# EAGLE design Arduino-Pro-Mini (EAGLE 9.5.1)
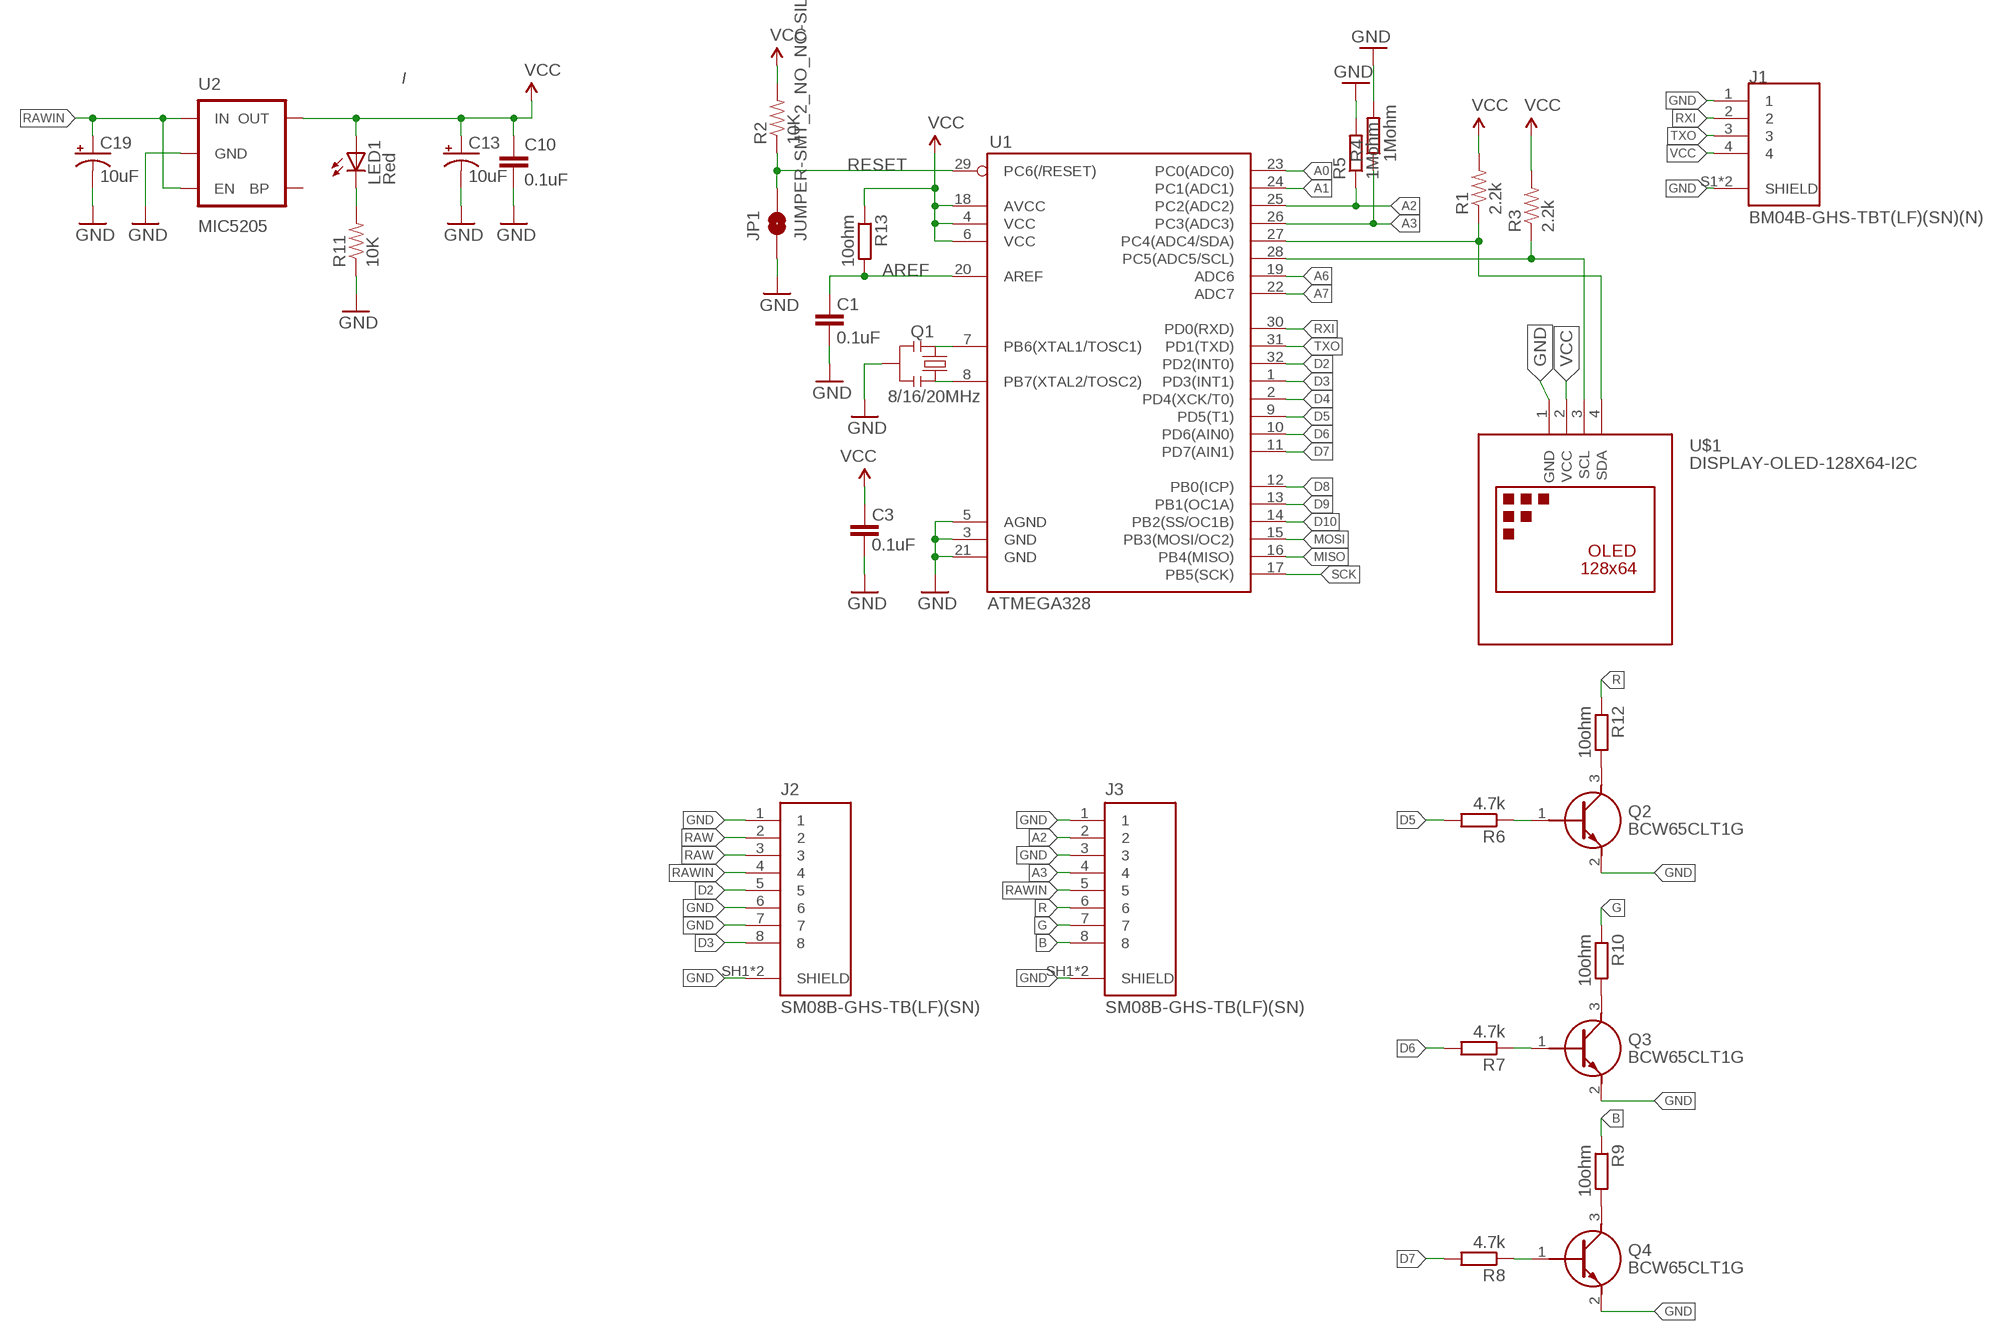
[diagram p0: schematic, sheet 1]

## Parts
C1  0.1uF  CAP0603-CAP  [0603-CAP]
C3  0.1uF  CAP0603-CAP  [0603-CAP]
C10  0.1uF  CAP0603-CAP  [0603-CAP]
C13  10uF  CAP_POL1206  [EIA3216]
C19  10uF  CAP_POL1206  [EIA3216]
J1  BM04B-GHS-TBT(LF)(SN)(N)  [JST_BM04B-GHS-TBT(LF)(SN)(N)]
J2  SM08B-GHS-TB(LF)(SN)  [JST_SM08B-GHS-TB(LF)(SN)]
J3  SM08B-GHS-TB(LF)(SN)  [JST_SM08B-GHS-TB(LF)(SN)]
JP1  JUMPER-SMT_2_NO_NO-SILK  [SMT-JUMPER_2_NO_NO-SILK]
LED1  Red  LED  [0603-LED-ALT1]
Q1  8/16/20MHz  RESONATOR1:1  [RESONATOR-SMD-1:1]
Q2  BCW65CLT1G  [SOT96P237X111-3N]
Q3  BCW65CLT1G  [SOT96P237X111-3N]
Q4  BCW65CLT1G  [SOT96P237X111-3N]
R1  2.2k  RESISTOR0603-RES  [0603-RES]
R2  10K  RESISTOR0603-RES  [0603-RES]
R3  2.2k  RESISTOR0603-RES  [0603-RES]
R4  1Mohm  RR0402  [R0402]
R5  1Mohm  RR0402  [R0402]
R6  4.7k  RR0402  [R0402]
R7  4.7k  RR0402  [R0402]
R8  4.7k  RR0402  [R0402]
R9  10ohm  RR0402  [R0402]
R10  10ohm  RR0402  [R0402]
R11  10K  RESISTOR0603-RES  [0603-RES]
R12  10ohm  RR0402  [R0402]
R13  10ohm  RR0402  [R0402]
U1  ATMEGA328  ATMEGA168  [TQFP32-08]
U2  MIC5205  V_REG_LDOSMD  [SOT23-5]
U$1  DISPLAY-OLED-128X64-I2C  [DISPLAY-OLED-128X64-I2C]

## Nets
A0: U1.23(PC0(ADC0))
A1: U1.24(PC1(ADC1))
A2: J3.2 R5.1 U1.25(PC2(ADC2))
A3 [vcc]: J3.4 R4.1 U1.26(PC3(ADC3))
A4: R1.1 U1.27(PC4(ADC4/SDA)) U$1.4(SDA)
A5: R3.1 U1.28(PC5(ADC5/SCL)) U$1.3(SCL)
A6: U1.19(ADC6)
A7: U1.22(ADC7)
AREF: C1.2 R13.2 U1.20(AREF)
B: J3.8 R9.1
D2: J2.5 U1.32(PD2(INT0))
D3: J2.8 U1.1(PD3(INT1))
D4: U1.2(PD4(XCK/T0))
D5: R6.2 U1.9(PD5(T1))
D6: R7.2 U1.10(PD6(AIN0))
D7: R8.2 U1.11(PD7(AIN1))
D8: U1.12(PB0(ICP))
D9: U1.13(PB1(OC1A))
D10: U1.14(PB2(SS/OC1B))
G: J3.7 R10.1
GND [vcc]: C1.1 C3.1 C10.2 C13.C(-) C19.C(-) J1.1 J1.S1(SHIELD) J1.S2(SHIELD) J2.1 J2.6 J2.7 J2.SH1(SHIELD) J2.SH2(SHIELD) J3.1 J3.3 J3.SH1(SHIELD) J3.SH2(SHIELD) JP1.1 Q1.2 Q2.2(E) Q3.2(E) Q4.2(E) R4.2 R5.2 R11.1 U1.3(GND) U1.5(AGND) U1.21(GND) U2.2(GND) U$1.1(GND)
MISO: U1.16(PB4(MISO))
MOSI: U1.15(PB3(MOSI/OC2))
N$1: Q1.3 U1.8(PB7(XTAL2/TOSC2))
N$2: Q1.1 U1.7(PB6(XTAL1/TOSC1))
N$3: Q4.1(B) R8.1
N$4: LED1.C R11.2
N$5: Q3.1(B) R7.1
N$6: Q2.1(B) R6.1
N$7: Q4.3(C) R9.2
N$8: Q3.3(C) R10.2
N$9: Q2.3(C) R12.2
R: J3.6 R12.1
RAW [vcc]: J2.2 J2.3
RAWIN [vcc]: C19.A(+) J2.4 J3.5 U2.1(IN) U2.3(EN)
RESET: JP1.2 R2.1 U1.29(PC6(/RESET))
RXI: J1.2 U1.30(PD0(RXD))
SCK: U1.17(PB5(SCK))
TXO: J1.3 U1.31(PD1(TXD))
VCC: C3.2 C10.1 C13.A(+) J1.4 LED1.A R1.2 R2.2 R3.2 R13.1 U1.4(VCC) U1.6(VCC) U1.18(AVCC) U2.5(OUT) U$1.2(VCC)
Unconnected: U2.4(BP)

## Library data of the parts
C1 C3 C10 = SparkFun:CAP: Capacitor Standard 0603 ceramic capacitor, and 0.1" leaded capacitor.
C13 C19 = SparkFun:CAP_POL: Capacitor Polarized These are standard SMD and PTH capacitors. Normally 10uF, 47uF, and 100uF in electrolytic and tantalum varieties. Always verify the external diameter of the through hole cap, it varies with capacity, voltage, and manufacturer. The EIA devices should be standard.
J1 = BM04B-GHS-TBT_LF__SN__N_:BM04B-GHS-TBT(LF)(SN)(N): Conn Shrouded Header HDR 4 POS 1.25mm Solder ST SMD Reel; AVAILABILITY: Unavailable; DESCRIPTION: Conn Shrouded Header HDR 4 POS 1.25mm Solder ST SMD Reel; MF: JST Sales; MP: BM04B-GHS-TBT_LF__SN__N_; PACKAGE: None; PRICE: None
J2 J3 = SM08B-GHS-TB_LF__SN_:SM08B-GHS-TB(LF)(SN): GH Series 8 Position 1.25 mm Pitch Side Entry Shrouded Header; AVAILABILITY: Unavailable; DESCRIPTION: GH Series 8 Position 1.25 mm Pitch Side Entry Shrouded Header; MF: JST Sales; MP: SM08B-GHS-TB_LF__SN_; PACKAGE: None; PRICE: None
JP1 = SparkFun-Jumpers:JUMPER-SMT_2_NO: Normally open jumper This jumper has two pads in close proximity to each other. Apply solder to close the connection. Round pads are easier to solder for beginners, but are a lot larger. SparkFun Product that uses the round pads: SparkFun EL Sequencer <https://www.sparkfun.com/products/12781>
LED1 = Testing:LED: LEDs Standard schematic elements and footprints for 5mm, 3mm, 1206, and 0603 sized LEDs. 5mm - Spark Fun Electronics SKU : COM-00529 (and others)
Q1 = Testing:RESONATOR: Resonator Small SMD resonator. This is the itty bitty 10/20MHz resonators with built in caps. CSTCE10M0G55 and CSTCE20M0V53. Footprint for SMD has been used in SFE production for years, and does work okay. 1:1 is an attempt to get larger fillets on the sides so it will be easier to inspect these solders in our AOI machine. The pads have been minimized to match the actual metal under the resonator. To see this relation, it includes an image import of the bottom side of the component. Imported to scale on layer 200.
Q2-Q4 = BCW65CLT1G:BCW65CLT1G: ON Semi BCW65CLT1G NPN Bipolar Transistor, 800 mA, 32 V, 3-Pin SOT-23 Source: Datasheet <http://uk.rs-online.com/web/p/products/8009686>; DESCRIPTION: ON Semi BCW65CLT1G NPN Bipolar Transistor, 800 mA, 32 V, 3-Pin SOT-23; HEIGHT: 1.11mm; MANUFACTURER_NAME: ON Semiconductor; MANUFACTURER_PART_NUMBER: BCW65CLT1G; MOUSER_PART_NUMBER: 863-BCW65CLT1G; MOUSER_PRICE-STOCK: https://www.mouser.com/Search/Refine.aspx?Keyword=863-BCW65CLT1G; RS_PART_NUMBER: 8009686P; RS_PRICE-STOCK: http://uk.rs-online.com/web/p/products/8009686P
R1-R3 R11 = SparkFun:RESISTOR: Resistor Basic schematic elements and footprints for 0603, 1206, and PTH resistors.
R4-R10 R12 R13 = eagle-ltspice:R: RESISTOR, European symbol; SPICEMODEL: NONE; SPICEPREFIX: R
U1 = SparkFun:ATMEGA168
U2 = SparkFun:V_REG_LDO: Voltage Regulator LDO Standard 150mA LDO voltage regulator in SOT-23 layout. Micrel part MIC5205. BP (by-pass) pin is used to lower output noise with 470pF cap.
U$1 = diy-modules:DISPLAY-OLED-128X64-I2C: 128x64 Dot Matrix OLED Module based on SSD1306 chip Variant with I2C interface More details available here: http://www.instructables.com/id/Monochrome-096-i2c-OLED-display-with-arduino-SSD13/ SSD1306 datasheet: https://cdn-shop.adafruit.com/datasheets/SSD1306.pdf Click here to find device on ebay.com <http://www.ebay.com/sch/oled+display+128x64+iic> Note: There are two variants: I2C and SPI. Search for the proper version.

## Net classes
0 default: width 0.203 mm
1 vcc: width 0.254 mm

## Board
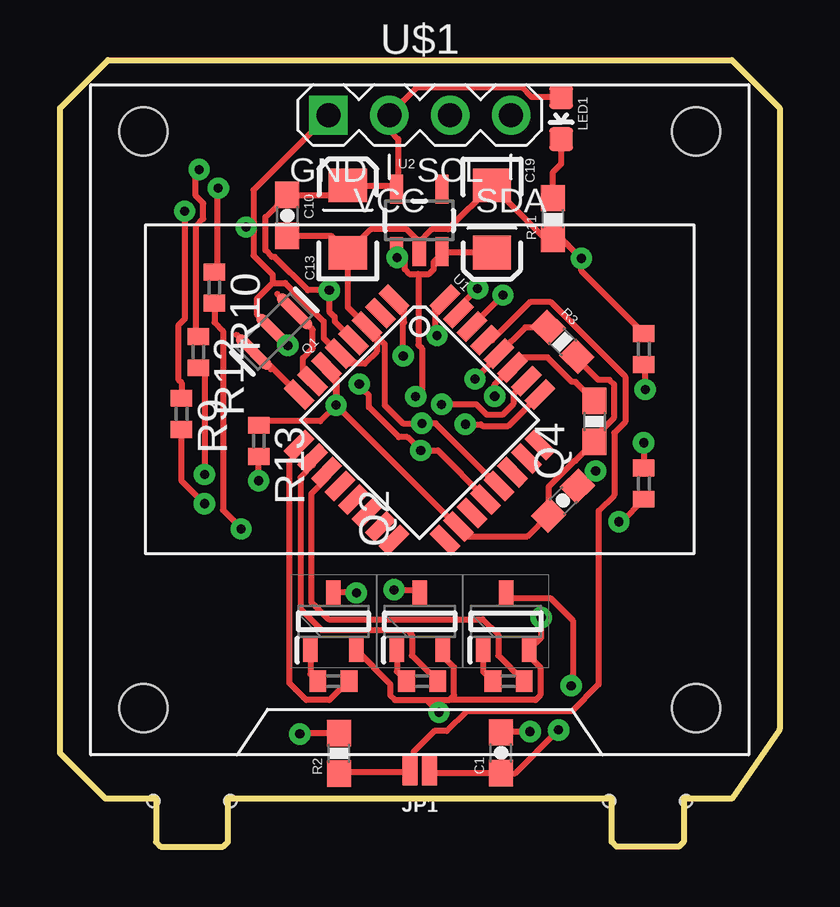
[diagram p1: board, top side]
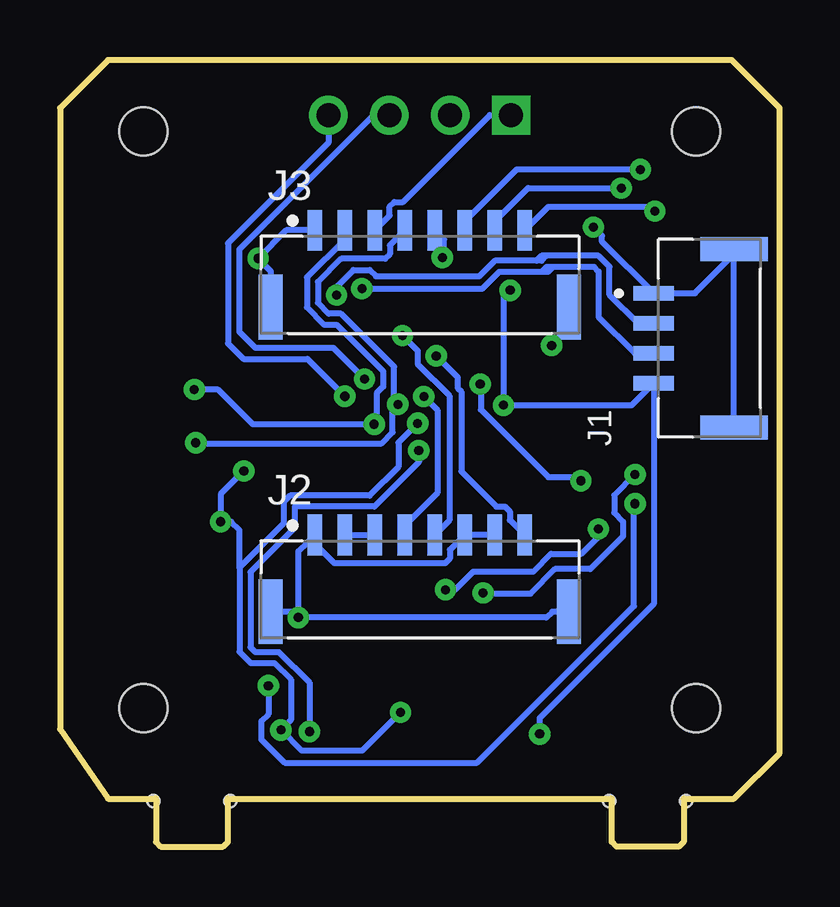
[diagram p2: board, bottom side, seen from below]

Size 30 x 32.8 mm. Coordinates in mm from the lower left corner, seen from the top.
Outline: 30,30.8 30,4.9 28,2 26,2 26,0.2 25.8,0 23.2,0 23,0.2 23,2 7,2 7,0.2 6.8,0 4.2,0 4,0.2 4,2 1.9,2 0,3.9 0,30.8 2,32.8 28,32.8 30,30.8
Copper layers (1*16): Top 0.035mm / dielectric 1.5mm / Bottom 0.035mm
Design rules "SparkFun-2-layer *": minimum track width 7mil, minimum drill 15mil, track to track 8mil, track to pad 8mil, pad to pad 8mil, via to via 8mil, smd to smd 8mil, copper to edge 8mil, drill to drill 8mil, minimum pad ring 12mil, minimum via ring 10mil, stop-mask expansion 4mil, vias tented up to drill 20mil, thermal gap 10mil
Holes 0.5 mm at 26.1,1.9 22.9,1.9 7.1,1.9 3.9,1.9

### Footprints (pad centres in the part's own frame; a part is rotated, then mirrored left to right if it is on the bottom)
0603-CAP = smd 1.1 x 1: 1 -0.85,0; 2 0.85,0
EIA3216 = smd 1.4 x 1.6: A 1.4,0; C -1.4,0
JST_BM04B-GHS-TBT(LF)(SN)(N) = smd 0.6 x 1.7: 1 1.875,3.35; 2 0.625,3.35; 3 -0.625,3.35; 4 -1.875,3.35 | smd 1 x 2.8: S1 -3.725,0; S2 3.725,0
JST_SM08B-GHS-TB(LF)(SN) = smd 0.6 x 1.7: 1 -4.375,0; 2 -3.125,0; 3 -1.875,0; 4 -0.625,0; 5 0.625,0; 6 1.875,0; 7 3.125,0; 8 4.375,0 | smd 1 x 2.7: SH1 -6.225,-3.2; SH2 6.225,-3.2
SMT-JUMPER_2_NO_NO-SILK = smd 0.635 x 1.27: 1 -0.406,0; 2 0.406,0
0603-LED-ALT1 = smd 1 x 1: A 0,-0.877; C 0,0.877
RESONATOR-SMD-1:1 = smd 0.45 x 1.905: 1 -1.2,0; 2 0,0; 3 1.2,0
SOT96P237X111-3N = smd 1 x 0.6: 1 -1.2,0.955; 2 -1.2,-0.955; 3 1.2,0
0603-RES = smd 1.1 x 1: 1 -0.85,0; 2 0.85,0
R0402 = smd 0.7 x 0.9: 1 -0.65,0; 2 0.65,0
TQFP32-08 = smd 1.27 x 0.559: 1 -4.293,2.8; 2 -4.293,2; 3 -4.293,1.2; 4 -4.293,0.4; 5 -4.293,-0.4; 6 -4.293,-1.2; 7 -4.293,-2; 8 -4.293,-2.8; 17 4.293,-2.8; 18 4.293,-2; 19 4.293,-1.2; 20 4.293,-0.4; 21 4.293,0.4; 22 4.293,1.2; 23 4.293,2; 24 4.293,2.8 | smd 0.559 x 1.27: 9 -2.8,-4.293; 10 -2,-4.293; 11 -1.2,-4.293; 12 -0.4,-4.293; 13 0.4,-4.293; 14 1.2,-4.293; 15 2,-4.293; 16 2.8,-4.293; 25 2.8,4.293; 26 2,4.293; 27 1.2,4.293; 28 0.4,4.293; 29 -0.4,4.293; 30 -1.2,4.293; 31 -2,4.293; 32 -2.8,4.293
SOT23-5 = smd 0.55 x 1.2: 1 -0.95,-1.3; 2 0,-1.3; 3 0.95,-1.3; 4 0.95,1.3; 5 -0.95,1.3
DISPLAY-OLED-128X64-I2C = drill 1 square: 1 -3.81,12.7 | drill 1: 2 -1.27,12.7; 3 1.27,12.7; 4 3.81,12.7 | hole 2: -11.525,12.025; 11.525,12.025; 11.525,-12.025; -11.525,-12.025

### Placement (x,y rotation side)
C1  18.39,3.92 90 top
C3  20.97,14.43 225 top
C10  9.48,26.32 270 top
C13  12,26.16 90 top
C19  18.01,26.17 270 top
J1  1.9,21.2 90 bottom
J2  15,13 0 bottom
J3  15,25.7 0 bottom
JP1  15,3.2 180 top
LED1  20.9,30.37 180 top
Q1  8.93,21.48 225 top
Q2  11.4,9.4 90 top
Q3  15,9.4 90 top
Q4  18.6,9.4 90 top
R1  22.28,17.74 270 top
R2  11.64,3.89 90 top
R3  20.95,21.05 315 top
R4  24.34,15.14 270 top
R5  24.34,20.75 90 top
R6  11.4,6.9 0 top
R7  15.1,6.9 0 top
R8  18.7,6.9 0 top
R9  5.07,18.05 270 top
R10  6.44,23.31 270 top
R11  20.56,26.19 90 top
R12  5.77,20.62 270 top
R13  8.29,16.92 270 top
U1  14.99,17.8 315 top
U2  14.98,26.11 0 top
U$1  15,17.8 0 top

### Tracks (layer width: path | path; a pad name or v marks a point on that pad's centre or on a via)
A2  (via drill 0.38)
  Top 0.254: v16.9,17.61 17.55,17.61 17.61,17.55 18.7,17.55 U1.25 | v24.4,19.06 24.4,20.04 R5.1
  Bottom 0.254: J3.2 18.12,25.32 19.7,23.74 19.7,22.49 18.98,21.77 18.47,21.77 16.52,19.82 16.52,19.18 16.8,18.91 16.8,17.72 v16.91,17.61 | v16.91,17.61 v16.9,17.61 | v24.4,19.06 23.4,19.06 21.95,17.61 v16.91,17.61
A3  (via drill 0.38)
  Top 0.254: U1.26 18.9,18.88 18.9,18.46 18.44,18 17.8,18 17.36,18.44 v15.91,18.44 | v24.34,16.84 R4.1
  Bottom 0.254: J3.4 16.25,25.08 16.25,24.71 16.44,24.52 18.27,24.52 19.25,23.55 19.25,22.68 18.79,22.23 18.28,22.23 16.07,20.01 16.07,18.6 v15.91,18.44 16.12,18.23 16.12,17.28 16.59,16.82 24.32,16.82 v24.34,16.84
A4  (via drill 0.38)
  Top 0.254: R1.1 21.49,19.38 21.35,19.38 20.33,20.4 19.25,20.4 18.87,20.02 | U1.27 18.87,20.02 | v18.12,18.78 18.12,19.27 18.87,20.02
  Bottom 0.254: U$1.4 18.81,29.34 22.99,25.16 22.99,20.98 22.35,20.34 19.68,20.34 v18.12,18.78
A5  (via drill 0.38)
  Top 0.254: R3.1 19.41,21.65 U1.28 18.31,20.51 v17.3,19.5
  Bottom 0.254: U$1.3 16.93,30.5 22.52,24.9 22.52,21.47 21.86,20.8 18.61,20.8 v17.3,19.5
AREF  (via drill 0.38)
  Top 0.254: v19.6,4.8 18.42,4.8 C1.2 | U1.20 17.74,14.53 15.75,16.52 v15.04,16.52 14.48,17.08 14.13,17.08 12.88,18.32 12.88,18.82 12.7,19 12.7,19.07 v12.48,19.29 | v8.28,15.26 v8.29,15.27 R13.2
  Bottom 0.254: v15.04,16.52 15.04,16.03 16.89,14.18 20.21,14.18 20.21,13.29 22.05,11.45 22.05,8.31 21.86,8.12 20.88,8.12 19.6,6.84 v19.6,4.8 | v12.48,19.29 12.45,19.26 12.45,18.22 9.64,15.41 8.28,15.41 v8.28,15.26
B  (via drill 0.38)
  Top 0.254: v5.2,26.5 5.2,22 4.93,21.74 4.93,19.48 5.07,19.35 R9.1
  Bottom 0.254: J3.8 9.64,26.68 5.38,26.68 v5.2,26.5
D2  (via drill 0.38)
  Top 0.254: v15.72,21.31 15.63,21.4 15.63,22.4 U1.32
  Bottom 0.254: J2.5 13.77,13.61 13.77,18.8 15.09,20.13 15.09,20.68 v15.72,21.31
D3  (via drill 0.38)
  Top 0.254: v14.31,20.46 14.31,21.83 14.35,21.86 14.35,22.4 U1.1
  Bottom 0.254: J2.8 11.24,13.62 11.24,13.99 11.44,14.18 11.8,14.18 13.27,15.64 13.27,18.97 13.43,19.13 13.43,19.57 v14.31,20.46
D5
  Top 0.254: U1.9 9.97,16.48 9.56,16.06 9.56,6.82 10.26,6.12 11.24,6.12 12.02,6.9 R6.2
D6
  Top 0.254: U1.10 10.54,15.91 10.02,15.39 10.02,9.91 10.9,9.03 14.48,9.03 14.68,8.84 14.68,7.97 R7.2
D7
  Top 0.254: U1.11 11.11,15.34 10.48,14.72 10.48,10.2 11.19,9.49 17.62,9.49 18.27,8.84 18.27,7.97 R8.2
G  (via drill 0.38)
  Top 0.254: R10.1 6.55,24.07 6.55,27.41 v6.6,27.46
  Bottom 0.254: J3.7 11.87,25.71 11.87,26.08 10.48,27.46 v6.6,27.46
GND  (via drill 0.38)
  Top 0.254: C10.2 11.3,25.47 C13.C | C13.C 12.98,25.74 14.44,25.74 14.98,25.2 U2.2 14.93,24.87 14.93,25.15 15.52,25.74 16.18,25.74 C19.C 20.24,25.34 R11.1 20.93,25.34 v21.74,24.53 21.74,24 R5.2 | U1.3 12,22.49 C13.C | U1.3 12.83,21.68 13.21,21.3 13.21,20.65 12.71,20.14 12.35,20.14 12.3,20.2 12.25,20.14 12.05,20.14 11.67,20.52 | U1.5 11.67,20.52 | 11.67,20.52 11,21.2 11,21.9 9.39,23.5 8.87,23.5 | 8.87,23.5 8.21,22.84 8.21,22.2 Q1.2 v9.5,20.9 | 8.87,23.5 8.87,23.85 8.07,24.65 8.07,25.83 | JP1.1 15.54,3.07 C1.1 18.99,3.07 v20.79,4.87 | U1.21 18.26,15.05 15.66,17.65 v15.09,17.65 14.3,17.65 13.54,18.41 13.54,20.95 U1.3 | v23.3,13.55 23.4,13.55 R4.2 | v20.06,9.56 20.06,8.71 Q4.2 19.55,7.96 20.03,7.49 20.03,6.31 19.84,6.12 | Q2.2 13.77,6.79 13.77,6.31 13.96,6.12 15.28,6.12 | 16.24,6.12 16.43,6.31 16.43,7.49 15.96,7.96 Q3.2 | 15.28,6.12 16.24,6.12 | 19.84,6.12 19.82,6.11 | 19.84,6.12 16.24,6.12 | 15.28,6.12 v15.8,5.6 | v7.76,25.83 8.07,25.83 | C3.1 21.7,15.03 v22.34,15.66 | 8.07,25.83 8.07,27.38 U$1.1
  Bottom 0.254: J1.S1 1.9,24.7 | 1.9,24.7 J1.S2 | v15.09,17.65 15.89,16.85 15.89,15.84 17.09,14.64 20.4,14.64 20.67,14.37 20.67,13.48 22.51,11.64 | v20.06,9.56 9.72,9.56 9.48,9.8 J2.SH2 | J2.7 J2.6 13.74,12.38 13.74,12.01 13.94,11.82 18.56,11.82 19.43,12.69 19.69,12.69 | J2.1 19.69,12.69 | 19.69,12.69 20.06,12.31 v20.06,9.56 | J3.SH1 21.21,22.51 21.21,24 v21.74,24.53 20.57,25.7 J3.1 | 1.9,24.7 3.52,23.07 J1.1 7.4,25.23 7.4,25.47 v7.76,25.83 | 22.51,11.64 22.51,8.12 22.05,7.66 21.07,7.66 20.38,6.97 20.38,5.28 v20.79,4.87 19.92,4 17.4,4 v15.8,5.6 | U$1.1 12.07,30.5 15.7,26.88 16.06,26.88 16.25,26.69 16.25,26.32 J3.3 | J3.SH2 8.78,21.62 v9.5,20.9 | 22.51,11.64 22.51,13.2 22.86,13.55 v23.3,13.55 23.3,14.7 v22.34,15.66 | v20.06,9.56 20.31,9.8 J2.SH1
N$1
  Top 0.254: U1.8 8.2,20.63 Q1.3
N$2
  Top 0.254: Q1.1 10.54,21.56 10.54,20.79 10.13,20.38 10.13,19.8 10.51,19.42 U1.7
N$3
  Top 0.254: Q4.1 17.64,7.3 R8.1
N$4
  Top 0.254: R11.2 20.56,28.13 20.9,28.47 LED1.C
N$5
  Top 0.254: Q3.1 14.04,7.3 R7.1
N$6
  Top 0.254: Q2.1 10.45,7.21 R6.1
N$7  (via drill 0.38)
  Top 0.254: Q4.3 18.83,10.37 20.45,10.37 21.38,9.43 21.38,6.78 v21.31,6.71 | v6.03,14.3 5.07,15.25 R9.2
  Bottom 0.254: v6.03,14.3 6.07,14.26 6.07,10.04 12.61,3.5 20.63,3.5 21.61,4.48 21.61,5.23 21.31,5.52 v21.31,6.71
N$8  (via drill 0.38)
  Top 0.254: v7.55,13.25 7.55,13.28 7.08,13.76 6.8,14.04 6.8,21.51 6.44,21.87 R10.2 | v13.93,10.71 14.89,10.71 Q3.3
  Bottom 0.254: v7.55,13.25 7.55,12.92 8.27,12.21 9.52,12.21 10.27,11.46 12.78,11.46 13.53,10.71 v13.93,10.71
N$9  (via drill 0.38)
  Top 0.254: R12.2 6.03,19.71 v6.03,15.52 | v12.36,10.58 12.34,10.6 Q2.3
  Bottom 0.254: v6.03,15.52 6.89,14.65 6.89,13.93 6.53,13.56 6.53,12.94 7.89,11.57 9.35,11.57 10.38,10.55 12.33,10.55 v12.36,10.58
R  (via drill 0.38)
  Top 0.254: v5.8,28.23 5.66,28.09 5.66,27.14 5.97,26.82 5.97,26.18 5.66,25.86 5.66,21.38 R12.1
  Bottom 0.254: J3.6 13.13,25.71 13.13,26.06 10.96,28.23 v5.8,28.23
RAW
  Bottom 0.254: J2.2 J2.3
RAWIN  (via drill 0.38)
  Top 0.254: C19.A 15.97,24.77 | 15.97,24.77 U2.3 | 14.95,23.88 14.57,23.88 14.38,24.07 14.38,24.46 U2.1 14.03,24.59 v14.06,24.57 | 15.97,24.77 15.59,24.39 15.59,24.07 15.39,23.88 14.95,23.88 | v14.83,18.77 15.09,19.03 15.09,20.78 14.95,20.92 14.95,23.88
  Bottom 0.254: J2.4 15.62,13.39 14.27,14.75 14.27,18.2 v14.83,18.77 | J3.5 13.99,25.31 13.99,24.64 v14.06,24.57
RESET
  Top 0.254: U1.29 18.01,21.12 19.62,22.72 20.45,22.72 23.57,19.6 23.57,17.71 23.11,17.25 23.11,14.65 22.46,14 22.46,6.76 21.34,5.65 16.94,5.65 16.12,4.82 15.61,4.82 14.76,3.97 14.76,3.36 JP1.2 14.69,3.1 11.69,3.1 R2.1
RXI  (via drill 0.38)
  Top 0.254: v18.47,23 17.18,21.71 U1.30
  Bottom 0.254: 7.55,24.64 9.92,24.64 10.13,24.43 11.87,24.43 | 7.55,24.64 9.71,24.64 9.92,24.43 11.87,24.43 | 11.87,24.43 12.52,23.78 16.83,23.78 17.09,24.04 17.77,24.04 18.47,23.34 v18.47,23 | 7.55,24.64 7.09,24.18 7.09,23 5.91,21.82 J1.2
TXO  (via drill 0.38)
  Top 0.254: v17.41,23.27 16.61,22.47 U1.31
  Bottom 0.254: 11.68,23.98 9.91,23.98 9.7,24.18 7.74,24.18 | 11.68,23.98 9.64,23.98 9.43,24.18 7.74,24.18 | J1.3 6.03,20.57 7.54,22.09 7.54,23.99 7.74,24.18 | 11.68,23.98 12.39,23.27 v17.41,23.27
VCC  (via drill 0.38)
  Top 0.254: R3.2 21.55,20.36 22.44,19.46 22.92,19.46 23.11,19.27 23.11,17.9 22.28,17.07 R1.2 21.5,16.1 21.47,16.1 20.37,15 C3.2 19.48,12.94 16.99,12.94 16.61,13.32 U1.18 16.57,13.35 11.53,18.39 | 20.88,31.27 LED1.A 19.66,31.25 19.28,31.64 14.87,31.64 U$1.2 13.73,29.87 14.1,29.5 14.1,27.48 U2.5 13.88,27.57 C13.A 11.6,27.17 C10.1 8.56,26.25 8.56,24.87 8.84,24.59 8.96,24.59 10.34,23.2 v11.23,23.2 11.23,22.32 11.46,22.09 11.46,21.9 U1.4 | v10,4.7 10.04,4.74 R2.2 | R13.1 8.46,17.74 10.84,17.74 v11.51,18.4 v11.51,18.41 11.53,18.39 | 11.53,18.39 11.53,19.57 U1.6 11.52,19.58 11.52,19.03 11.51,19.03 v11.51,18.41
  Bottom 0.254: v11.23,23.2 11.51,22.92 v11.51,18.41 6.17,18.41 J1.4 5.25,10.12 10,5.37 v10,4.7